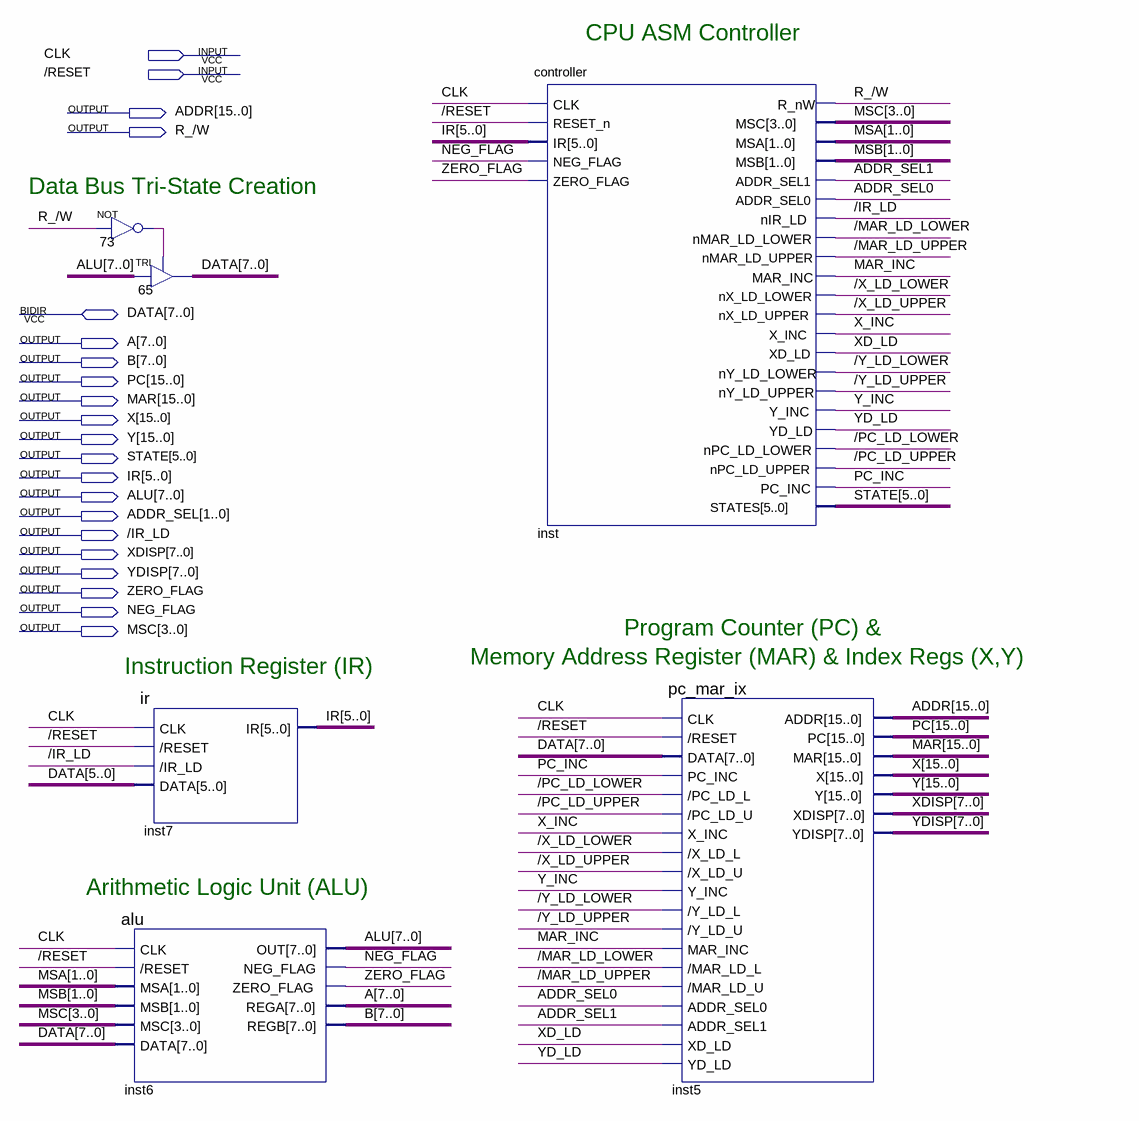
[diagram p0: schematic sheet]
// Quartus schematic cpu.bdf as structural Verilog: 6 symbols, 21 pins
module cpu (
  input  CLK,
  input  \/RESET ,
  inout  [7:0] DATA,
  output [15:0] ADDR,
  output \R_/W ,
  output [7:0] A,
  output [7:0] B,
  output [15:0] PC,
  output [15:0] MAR,
  output [15:0] X,
  output [15:0] Y,
  output [5:0] STATE,
  output [5:0] IR,
  output [7:0] ALU,
  output [1:0] ADDR_SEL,
  output \/IR_LD ,
  output [7:0] XDISP,
  output [7:0] YDISP,
  output ZERO_FLAG,
  output NEG_FLAG,
  output [3:0] MSC
);

  wire \/MAR_LD_LOWER , \/MAR_LD_UPPER , \/PC_LD_LOWER , \/PC_LD_UPPER , \/X_LD_LOWER , \/X_LD_UPPER ,
       \/Y_LD_LOWER , \/Y_LD_UPPER , MAR_INC, n73_out, PC_INC, X_INC, XD_LD, Y_INC, YD_LD;
  wire [1:0] MSA, MSB;

  not u_73 (n73_out, \R_/W );
  TRI u_65[7:0] (.IN(ALU), .OE(n73_out), .OUT(DATA));
  ir inst7 (.CLK(CLK), .\/RESET (\/RESET ), .\/IR_LD (\/IR_LD ), .DATA(DATA[5:0]), .IR(IR));
  alu inst6 (
    .CLK(CLK), .\/RESET (\/RESET ), .MSA(MSA), .MSB(MSB), .MSC(MSC), .DATA(DATA), .OUT(ALU),
    .NEG_FLAG(NEG_FLAG), .ZERO_FLAG(ZERO_FLAG), .REGA(A), .REGB(B));
  controller inst (
    .CLK(CLK), .RESET_n(\/RESET ), .IR(IR), .NEG_FLAG(NEG_FLAG), .ZERO_FLAG(ZERO_FLAG), .R_nW(\R_/W ),
    .MSC(MSC), .MSA(MSA), .MSB(MSB), .ADDR_SEL1(ADDR_SEL[1]), .ADDR_SEL0(ADDR_SEL[0]), .nIR_LD(\/IR_LD ),
    .nMAR_LD_LOWER(\/MAR_LD_LOWER ), .nMAR_LD_UPPER(\/MAR_LD_UPPER ), .MAR_INC(MAR_INC),
    .nX_LD_LOWER(\/X_LD_LOWER ), .nX_LD_UPPER(\/X_LD_UPPER ), .X_INC(X_INC), .XD_LD(XD_LD),
    .nY_LD_LOWER(\/Y_LD_LOWER ), .nY_LD_UPPER(\/Y_LD_UPPER ), .Y_INC(Y_INC), .YD_LD(YD_LD),
    .nPC_LD_LOWER(\/PC_LD_LOWER ), .nPC_LD_UPPER(\/PC_LD_UPPER ), .PC_INC(PC_INC), .STATES(STATE));
  pc_mar_ix inst5 (
    .CLK(CLK), .\/RESET (\/RESET ), .DATA(DATA), .PC_INC(PC_INC), .\/PC_LD_L (\/PC_LD_LOWER ),
    .\/PC_LD_U (\/PC_LD_UPPER ), .X_INC(X_INC), .\/X_LD_L (\/X_LD_LOWER ), .\/X_LD_U (\/X_LD_UPPER ),
    .Y_INC(Y_INC), .\/Y_LD_L (\/Y_LD_LOWER ), .\/Y_LD_U (\/Y_LD_UPPER ), .MAR_INC(MAR_INC),
    .\/MAR_LD_L (\/MAR_LD_LOWER ), .\/MAR_LD_U (\/MAR_LD_UPPER ), .ADDR_SEL0(ADDR_SEL[0]),
    .ADDR_SEL1(ADDR_SEL[1]), .XD_LD(XD_LD), .YD_LD(YD_LD), .ADDR(ADDR), .PC(PC), .MAR(MAR), .X(X), .Y(Y),
    .XDISP(XDISP), .YDISP(YDISP));

  // Notes on the sheet:
  //   CPU ASM Controller
  //   Data Bus Tri-State Creation
  //   Program Counter (PC) &
  //   Memory Address Register (MAR) & Index Regs (X,Y)
  //   Instruction Register (IR)
  //   Arithmetic Logic Unit (ALU)
endmodule
